# EasyEDA schematic SCH_Cole-Project_2025-10-19.json
TITLE: Sheet_1; REV: 1.0; Date: 2025-10-19; Sheet: 1/1; Drawn By: crrthompson2014; Company: Your Company
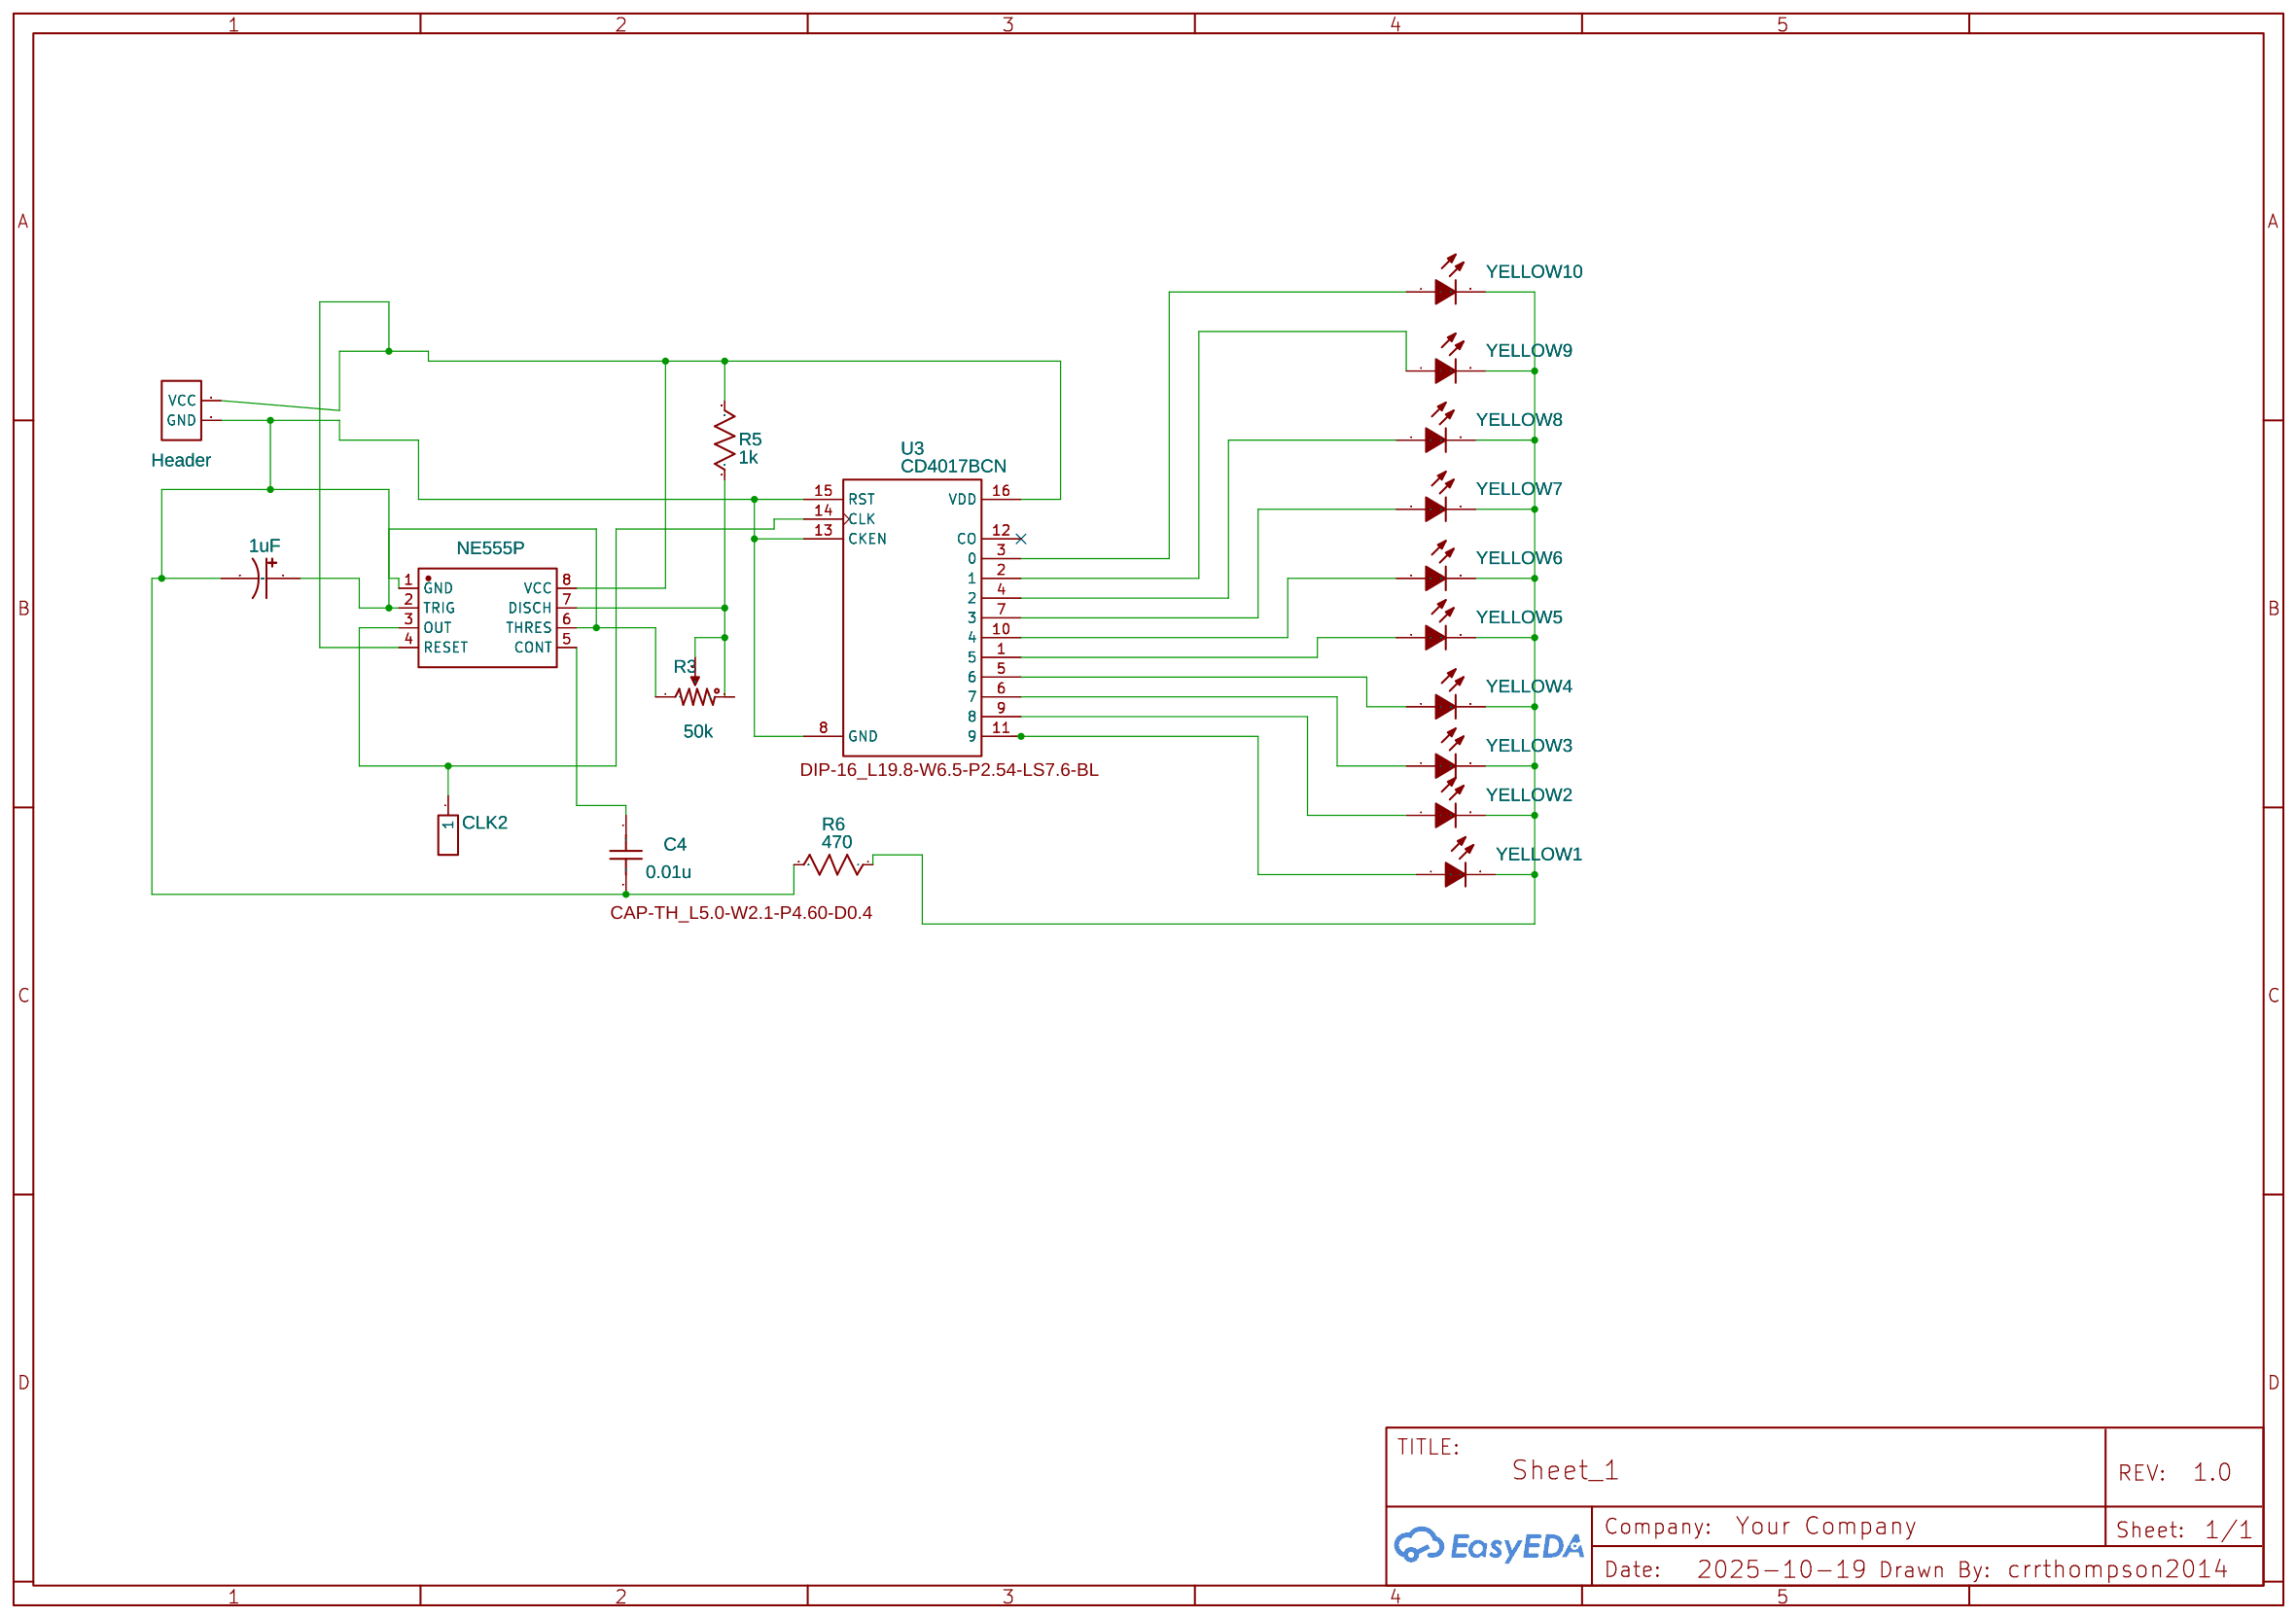
[diagram p0: schematic sheet]

## Parts
C3  1uF  [CAP-TH_BD5.0-P2.00-D0.8-FD]
C4  0.01u  [CAP-TH_L5.0-W2.1-P4.60-D0.4]
CLK2  C81276  [HDR-TH_1P-P2.54-V-M]
H2  Header  [HDR-M-2.54_1X2]
R3  50k  [RES-ADJ-3296X]
R5  1k  [R_AXIAL-0.3]
R6  470  [R_AXIAL-0.3]
U1  NE555P  [DIP-8_L9.8-W6.6-P2.54-LS7.6-BL]
U3  CD4017BCN  [DIP-16_L19.8-W6.5-P2.54-LS7.6-BL]
YELLOW1  LED_5MM  [LED-TH_BD5.0-P2.54-FD_C9900023552]
YELLOW2  LED_5MM  [LED-TH_BD5.0-P2.54-FD_C9900023552]
YELLOW3  LED_5MM  [LED-TH_BD5.0-P2.54-FD_C9900023552]
YELLOW4  LED_5MM  [LED-TH_BD5.0-P2.54-FD_C9900023552]
YELLOW5  LED_5MM  [LED-TH_BD5.0-P2.54-FD_C9900023552]
YELLOW6  LED_5MM  [LED-TH_BD5.0-P2.54-FD_C9900023552]
YELLOW7  LED_5MM  [LED-TH_BD5.0-P2.54-FD_C9900023552]
YELLOW8  LED_5MM  [LED-TH_BD5.0-P2.54-FD_C9900023552]
YELLOW9  LED_5MM  [LED-TH_BD5.0-P2.54-FD_C9900023552]
YELLOW10  LED_5MM  [LED-TH_BD5.0-P2.54-FD_C9900023552]

## Library data of the parts
C3 = UVZ1H010MDD: Contributor: LCSC; Supplier: LCSC; Supplier Part: C62934; Manufacturer: Nichicon(尼吉康)
C4 = C_0603_US: Supplier Part: C249157; Supplier: LCSC; Contributor: LCEDA_Lib; Package Display: Yes
CLK2 = Header-Male-2.54_1x1: Supplier: LCSC; Manufacturer Part: 2.54-1*1P针; JLCPCB Part Class: Extended Part; Package Display: No; Manufacturer: BOOMELE(Boom Precision Elec); Contributor: Thejo Prakash
H2 = HEADER-FEMALE-2.54_1X2: Contributor: nonstop2004; Supplier: LCSC; Supplier Part: C492401; Package Display: No
R3 = Potentiometer: K(%): 50; Manufacturer Part: ?; Supplier: LCSC; Supplier Part: C118912; Package Display: No
R5 = Resistor: Manufacturer Part: ?; Supplier Part: C713997; Supplier: LCSC
R6 = Resistor: Manufacturer Part: ?; Supplier Part: C58592; Supplier: LCSC
U1 = NE555P: Supplier: LCSC; Manufacturer: TI(德州仪器); Supplier Part: C46749; JLCPCB Part Class: Extended Part
U3 = CD4017BCN: Decade CounterDivider with 10 Decoded Outputs; Supplier: LCSC; Supplier Part: C32710674; Package Display: Yes
YELLOW1-YELLOW10 = LED_5MM: Contributor: lcsc; Supplier: LCSC; Supplier Part: C330770

## Nets
Net-(C3-1): C3.1 R3.1 U1.2(TRIG) U1.6(THRES)
Net-(C3-2): C3.2 C4.2 H2.2(GND) R6.2 U1.1(GND) U3.8(GND) U3.13(CKEN) U3.15(RST)
Net-(C4-1): C4.1 U1.5(CONT)
Net-(CLK2-1): CLK2.1 U1.3(OUT) U3.14(CLK)
Net-(H2-1): H2.1(VCC) R5.2 U1.4(RESET) U1.8(VCC) U3.16(VDD)
Net-(R3-2): R3.2(3) R3.3(2) R5.1 U1.7(DISCH)
Net-(R6-1): R6.1 YELLOW1.2(K) YELLOW2.2(K) YELLOW3.2(K) YELLOW4.2(K) YELLOW5.2(K) YELLOW6.2(K) YELLOW7.2(K) YELLOW8.2(K) YELLOW9.2(K) YELLOW10.2(K)
Net-(U3-1): U3.1(5) YELLOW5.1(A)
Net-(U3-2): U3.2(1) YELLOW9.1(A)
Net-(U3-3): U3.3(0) YELLOW10.1(A)
Net-(U3-4): U3.4(2) YELLOW8.1(A)
Net-(U3-5): U3.5(6) YELLOW4.1(A)
Net-(U3-6): U3.6(7) YELLOW3.1(A)
Net-(U3-7): U3.7(3) YELLOW7.1(A)
Net-(U3-9): U3.9(8) YELLOW2.1(A)
Net-(U3-10): U3.10(4) YELLOW6.1(A)
Net-(U3-11): U3.11(9) YELLOW1.1(A)

Not connected (* = marked no-connect by the designer): U3 12(CO)*
